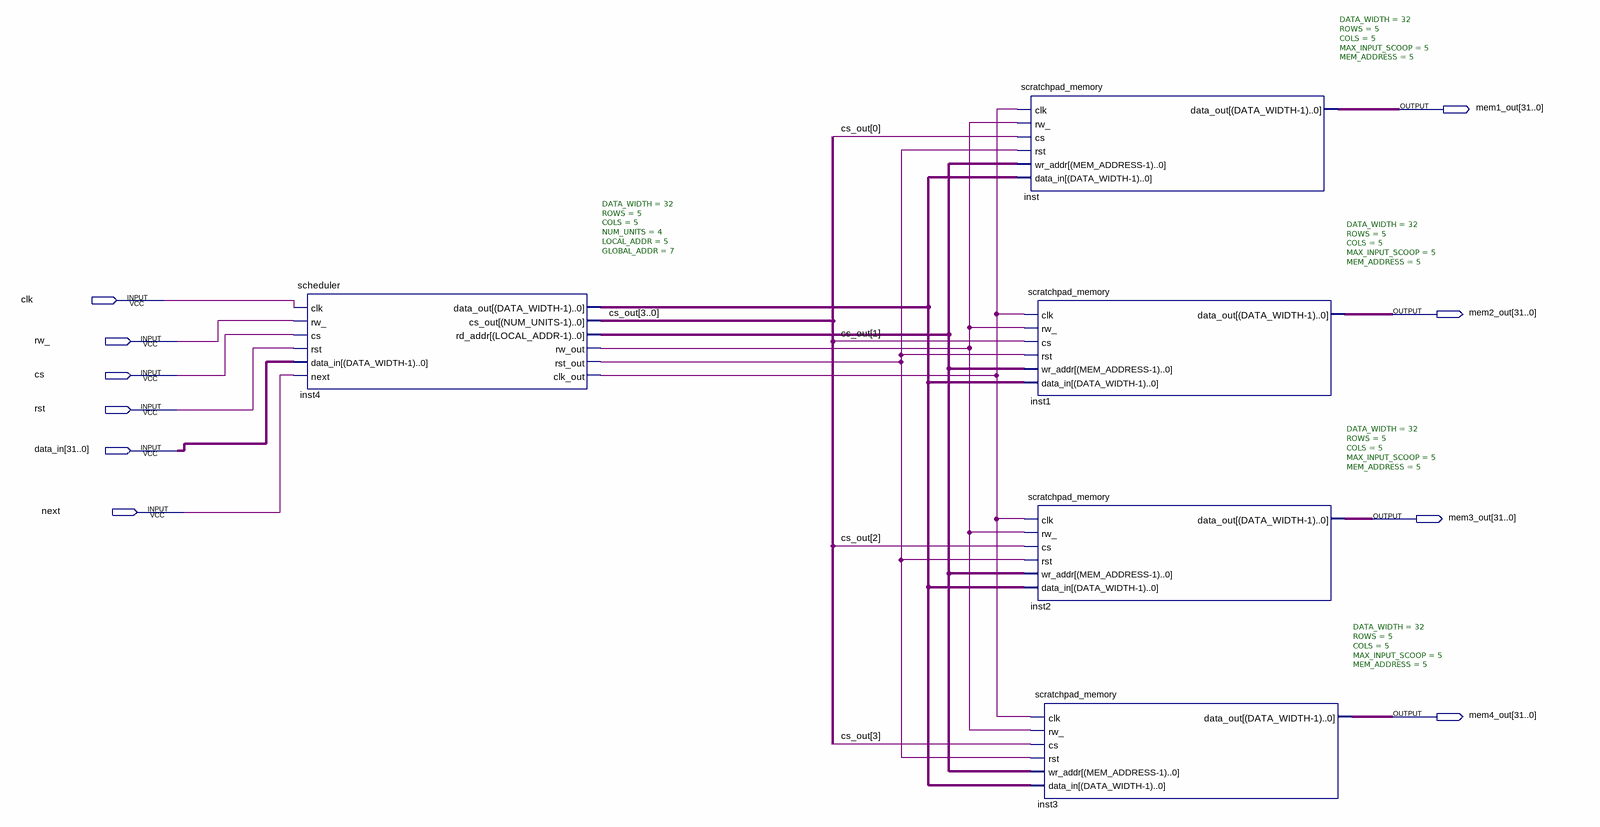
[diagram p0: schematic sheet]
// Quartus schematic narayan.bdf as structural Verilog: 5 symbols, 10 pins
module narayan (
  input  clk,
  input  rw_,
  input  cs,
  input  rst,
  input  [31:0] data_in,
  input  next,
  output [31:0] mem1_out,
  output [31:0] mem2_out,
  output [31:0] mem3_out,
  output [31:0] mem4_out
);

  wire inst4_clk_out, inst4_rst_out, inst4_rw_out;
  wire [3:0] cs_out;
  wire [4:0] inst4_rd_addr;
  wire [31:0] inst4_data_out;

  scheduler #(.DATA_WIDTH(32), .ROWS(5), .COLS(5), .NUM_UNITS(4), .LOCAL_ADDR(5), .GLOBAL_ADDR(7)) inst4 (
    .clk(clk), .rw_(rw_), .cs(cs), .rst(rst), .data_in(data_in), .next(next), .data_out(inst4_data_out),
    .cs_out(cs_out), .rd_addr(inst4_rd_addr), .rw_out(inst4_rw_out), .rst_out(inst4_rst_out),
    .clk_out(inst4_clk_out));
  scratchpad_memory #(.DATA_WIDTH(32), .ROWS(5), .COLS(5), .MAX_INPUT_SCOOP(5), .MEM_ADDRESS(5)) inst (
    .clk(inst4_clk_out), .rw_(inst4_rw_out), .cs(cs_out[0]), .rst(inst4_rst_out), .wr_addr(inst4_rd_addr),
    .data_in(inst4_data_out), .data_out(mem1_out));
  scratchpad_memory #(.DATA_WIDTH(32), .ROWS(5), .COLS(5), .MAX_INPUT_SCOOP(5), .MEM_ADDRESS(5)) inst1 (
    .clk(inst4_clk_out), .rw_(inst4_rw_out), .cs(cs_out[1]), .rst(inst4_rst_out), .wr_addr(inst4_rd_addr),
    .data_in(inst4_data_out), .data_out(mem2_out));
  scratchpad_memory #(.DATA_WIDTH(32), .ROWS(5), .COLS(5), .MAX_INPUT_SCOOP(5), .MEM_ADDRESS(5)) inst2 (
    .clk(inst4_clk_out), .rw_(inst4_rw_out), .cs(cs_out[2]), .rst(inst4_rst_out), .wr_addr(inst4_rd_addr),
    .data_in(inst4_data_out), .data_out(mem3_out));
  scratchpad_memory #(.DATA_WIDTH(32), .ROWS(5), .COLS(5), .MAX_INPUT_SCOOP(5), .MEM_ADDRESS(5)) inst3 (
    .clk(inst4_clk_out), .rw_(inst4_rw_out), .cs(cs_out[3]), .rst(inst4_rst_out), .wr_addr(inst4_rd_addr),
    .data_in(inst4_data_out), .data_out(mem4_out));
endmodule
